# EAGLE schematic Placa_processamento (EAGLE 9.6.2)
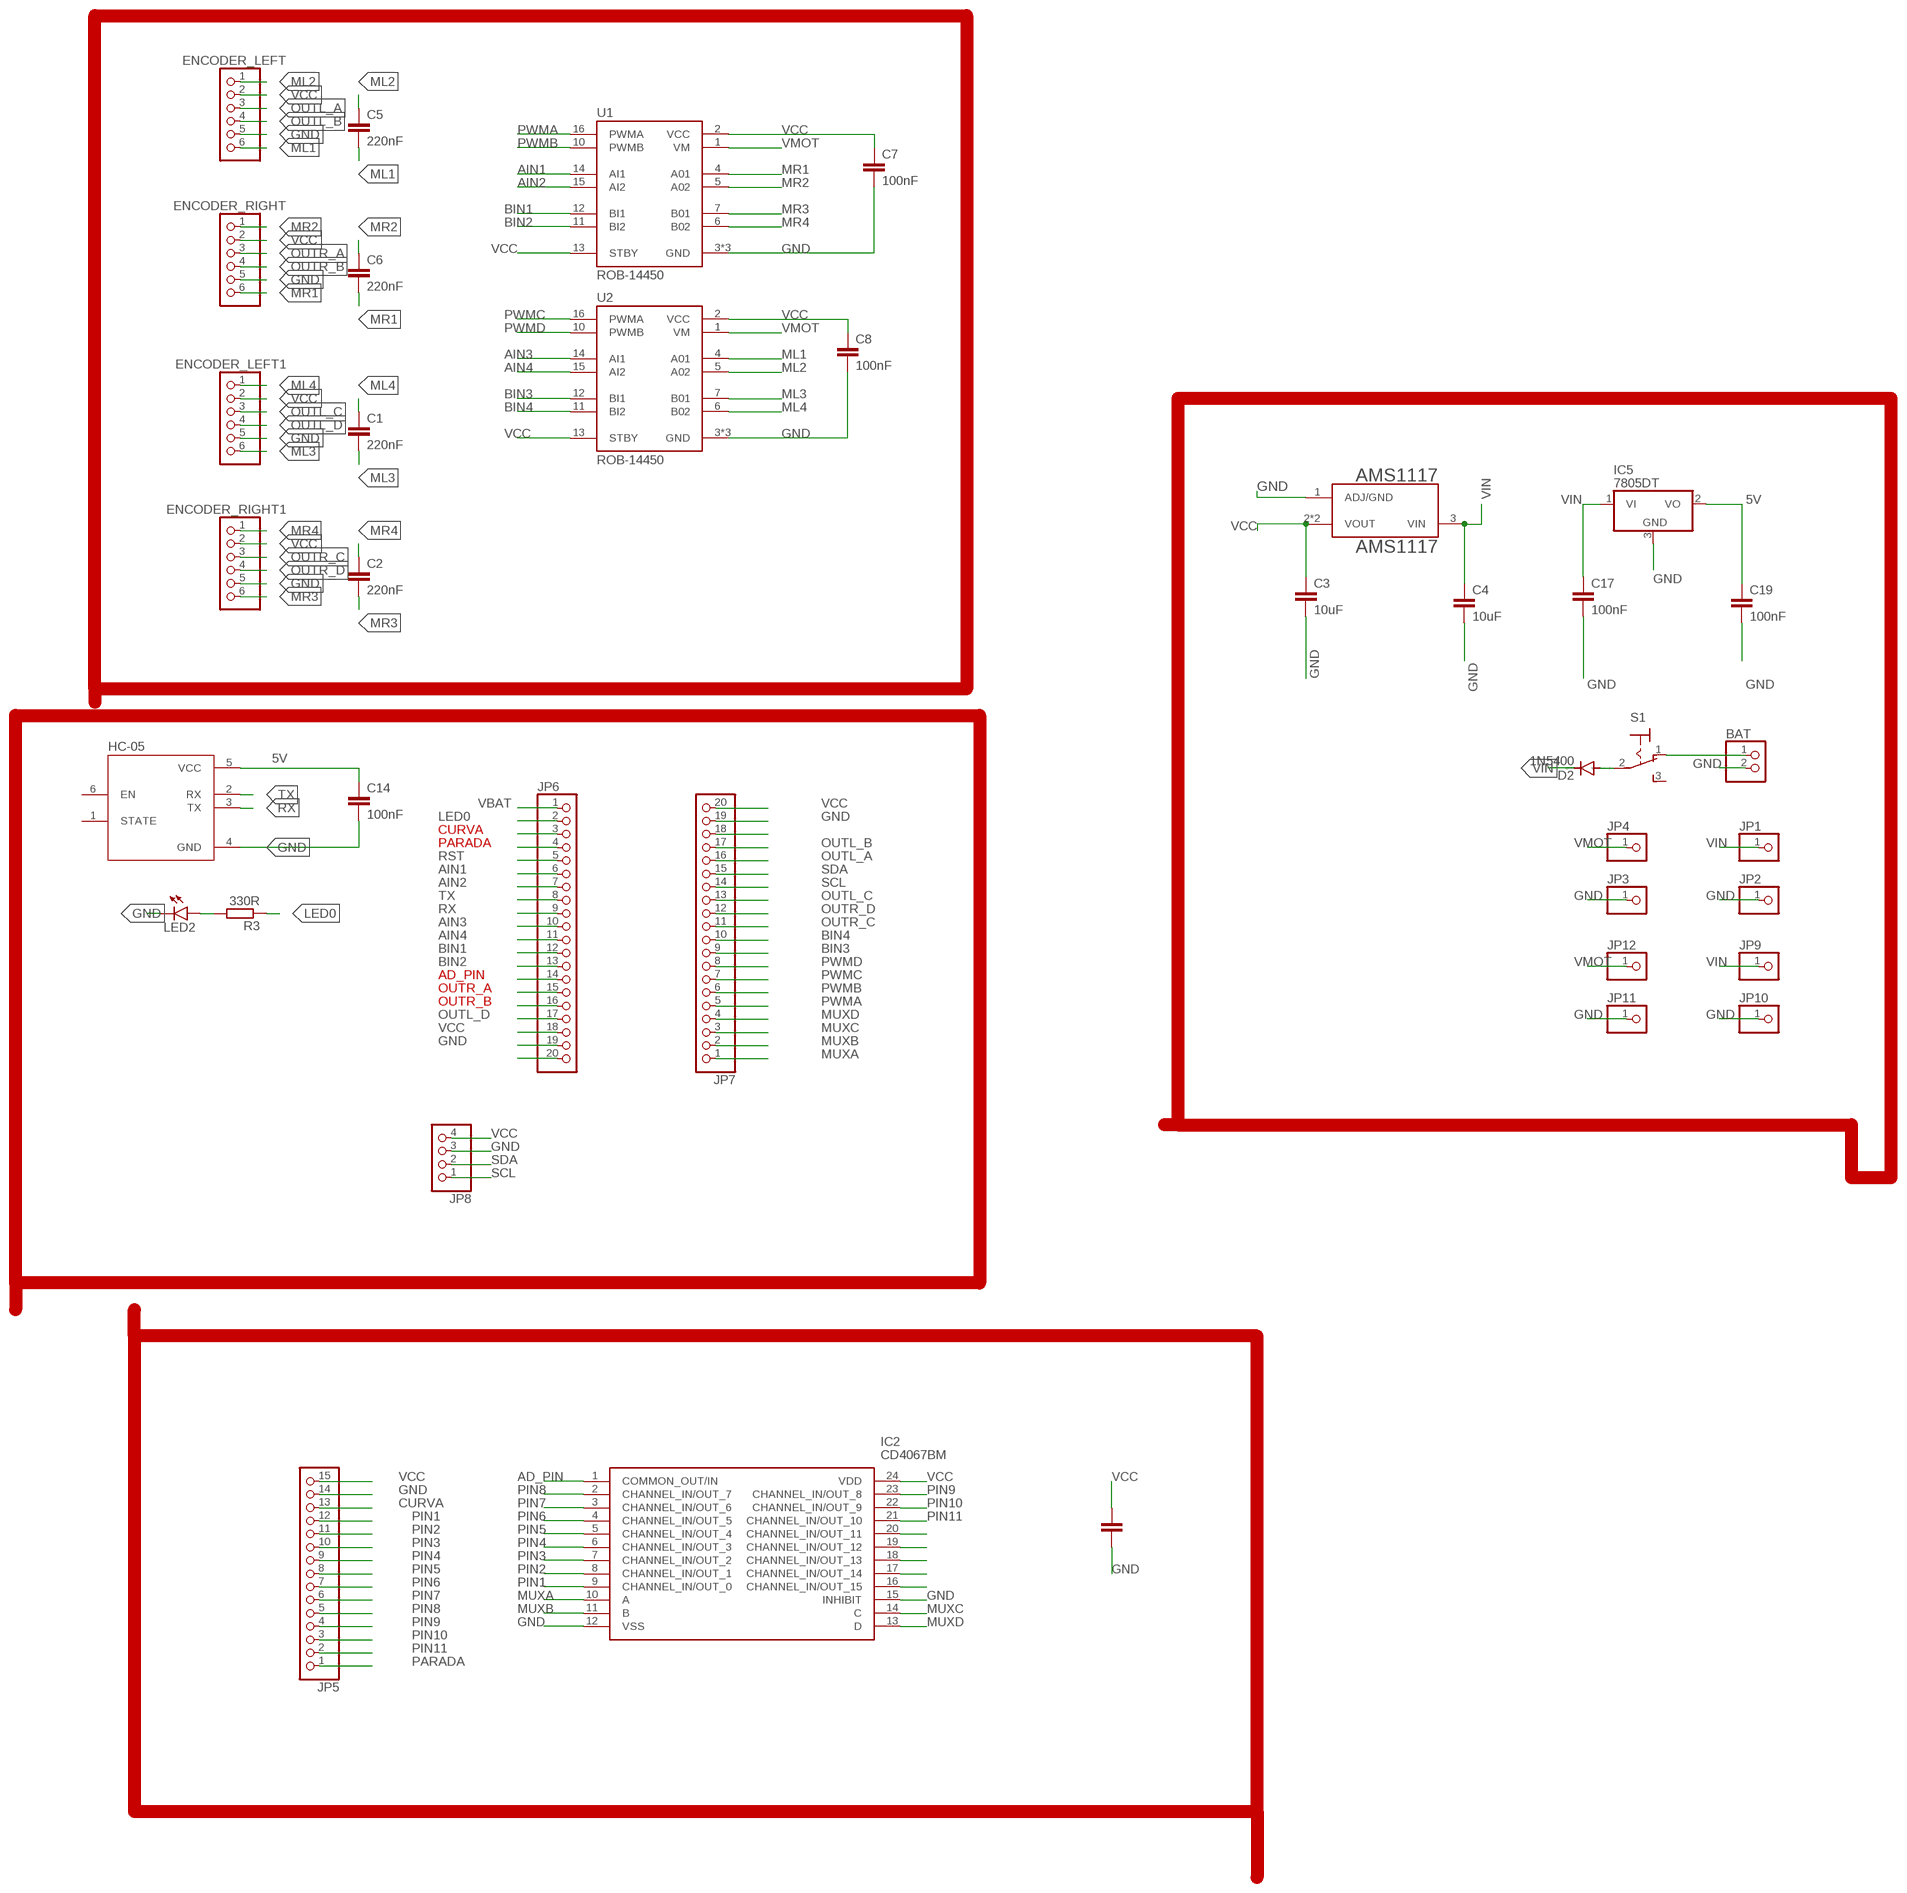
[diagram p0: schematic, sheet 1]

## Parts
AMS1117  AMS1117  [SOT229P700X180-4N]
BAT  PINHD-1X2  [1X02]
C1  220nF  C-EUC0805  [C0805]
C2  220nF  C-EUC0805  [C0805]
C3  10uF  C-EUC0805  [C0805]
C4  10uF  C-EUC0805  [C0805]
C5  220nF  C-EUC0805  [C0805]
C6  220nF  C-EUC0805  [C0805]
C7  100nF  C-EUC0805  [C0805]
C8  100nF  C-EUC0805  [C0805]
C10  100nF  C-EUC0805  [C0805]
C14  100nF  C-EUC0805  [C0805]
C17  100nF  C-EUC0805  [C0805]
C19  100nF  C-EUC0805  [C0805]
D2  1N5400  [DO201-15]
ENCODER_LEFT  PINHD-1X6  [1X06]
ENCODER_LEFT1  PINHD-1X6  [1X06]
ENCODER_RIGHT  PINHD-1X6  [1X06]
ENCODER_RIGHT1  PINHD-1X6  [1X06]
HC-05  ZC142200  [MODULE_ZC142200]
IC2  CD4067BM  [SOIC127P1030X265-24N]
IC5  7805DT  [TO252]
JP1  PINHD-1X1  [1X01]
JP2  PINHD-1X1  [1X01]
JP3  PINHD-1X1  [1X01]
JP4  PINHD-1X1  [1X01]
JP5  PINHD-1X15  [1X15]
JP6  PINHD-1X20  [1X20]
JP7  PINHD-1X20  [1X20]
JP8  PINHD-1X4  [1X04]
JP9  PINHD-1X1  [1X01]
JP10  PINHD-1X1  [1X01]
JP11  PINHD-1X1  [1X01]
JP12  PINHD-1X1  [1X01]
LED2  LEDCHIPLED_0805  [CHIPLED_0805]
R3  330R  R-EU_R0805  [R0805]
S1  320-916  [320-916]
U1  ROB-14450  [MODULE_ROB-14450]
U2  ROB-14450  [MODULE_ROB-14450]

## Nets
5V: C14.1 C19.1 HC-05.5(VCC) IC5.2(VO)
AD_PIN: IC2.1(COMMON_OUT/IN) JP6.14
AIN1: JP6.6 U1.14(AI1)
AIN2: JP6.7 U1.15(AI2)
AIN3: JP6.10 U2.14(AI1)
AIN4: JP6.11 U2.15(AI2)
BIN1: JP6.12 U1.12(BI1)
BIN2: JP6.13 U1.11(BI2)
BIN3: JP7.9 U2.12(BI1)
BIN4: JP7.10 U2.11(BI2)
CURVA: JP5.13 JP6.3
GND: AMS1117.1(ADJ/GND) BAT.2 C3.2 C4.2 C7.2 C8.2 C10.2 C14.2 C17.2 C19.2 ENCODER_LEFT1.5 ENCODER_LEFT.5 ENCODER_RIGHT1.5 ENCODER_RIGHT.5 HC-05.4(GND) IC2.12(VSS) IC2.15(INHIBIT) IC5.3(GND) JP2.1 JP3.1 JP5.14 JP6.19 JP7.19 JP8.3 JP10.1 JP11.1 LED2.C U1.3(GND) U1.8(GND) U1.9(GND) U2.3(GND) U2.8(GND) U2.9(GND)
LED0: JP6.2 R3.1
ML1: C5.2 ENCODER_LEFT.6 U2.4(A01)
ML2: C5.1 ENCODER_LEFT.1 U2.5(A02)
ML3: C1.2 ENCODER_LEFT1.6 U2.7(B01)
ML4: C1.1 ENCODER_LEFT1.1 U2.6(B02)
MR1: C6.2 ENCODER_RIGHT.6 U1.4(A01)
MR2: C6.1 ENCODER_RIGHT.1 U1.5(A02)
MR3: C2.2 ENCODER_RIGHT1.6 U1.7(B01)
MR4: C2.1 ENCODER_RIGHT1.1 U1.6(B02)
MUXA: IC2.10(A) JP7.1
MUXB: IC2.11(B) JP7.2
MUXC: IC2.14(C) JP7.3
MUXD: IC2.13(D) JP7.4
N$2: D2.A S1.2(P)
N$3: BAT.1 S1.1(O)
N$4: LED2.A R3.2
N$19: IC2.16(CHANNEL_IN/OUT_15)
N$20: IC2.17(CHANNEL_IN/OUT_14)
N$21: IC2.18(CHANNEL_IN/OUT_13)
N$22: IC2.19(CHANNEL_IN/OUT_12)
N$38: JP6.20
NET: JP7.18
NET$7: IC2.20(CHANNEL_IN/OUT_11)
OUTL_A: ENCODER_LEFT.3 JP7.16
OUTL_B: ENCODER_LEFT.4 JP7.17
OUTL_C: ENCODER_LEFT1.3 JP7.13
OUTL_D: ENCODER_LEFT1.4 JP6.17
OUTR_A: ENCODER_RIGHT.3 JP6.15
OUTR_B: ENCODER_RIGHT.4 JP6.16
OUTR_C: ENCODER_RIGHT1.3 JP7.11
OUTR_D: ENCODER_RIGHT1.4 JP7.12
PARADA: JP5.1 JP6.4
PIN1: IC2.9(CHANNEL_IN/OUT_0) JP5.12
PIN2: IC2.8(CHANNEL_IN/OUT_1) JP5.11
PIN3: IC2.7(CHANNEL_IN/OUT_2) JP5.10
PIN4: IC2.6(CHANNEL_IN/OUT_3) JP5.9
PIN5: IC2.5(CHANNEL_IN/OUT_4) JP5.8
PIN6: IC2.4(CHANNEL_IN/OUT_5) JP5.7
PIN7: IC2.3(CHANNEL_IN/OUT_6) JP5.6
PIN8: IC2.2(CHANNEL_IN/OUT_7) JP5.5
PIN9: IC2.23(CHANNEL_IN/OUT_8) JP5.4
PIN10: IC2.22(CHANNEL_IN/OUT_9) JP5.3
PIN11: IC2.21(CHANNEL_IN/OUT_10) JP5.2
PWMA: JP7.5 U1.16(PWMA)
PWMB: JP7.6 U1.10(PWMB)
PWMC: JP7.7 U2.16(PWMA)
PWMD: JP7.8 U2.10(PWMB)
RST: JP6.5
RX: HC-05.3(TX) JP6.9
SCL: JP7.14 JP8.1
SDA: JP7.15 JP8.2
TX: HC-05.2(RX) JP6.8
VBAT: JP6.1
VCC: AMS1117.2(VOUT) AMS1117.4(VOUT) C3.1 C7.1 C8.1 C10.1 ENCODER_LEFT1.2 ENCODER_LEFT.2 ENCODER_RIGHT1.2 ENCODER_RIGHT.2 IC2.24(VDD) JP5.15 JP6.18 JP7.20 JP8.4 U1.2(VCC) U1.13(STBY) U2.2(VCC) U2.13(STBY)
VIN: AMS1117.3(VIN) C4.1 C17.1 D2.C IC5.1(VI) JP1.1 JP9.1
VMOT: JP4.1 JP12.1 U1.1(VM) U2.1(VM)
Unconnected: HC-05.1(STATE) HC-05.6(EN) S1.3(S)

## Library data of the parts
AMS1117 = AMS1117_REGULADOR:AMS1117: Sot223/Pkg 1-Amp 5-Volt Low Drop Out Voltage Regulatator Check prices <https://pricing.snapeda.com/parts/AMS1117/Advanced%20Monolithic%20Systems/view-part?ref=eda>; AVAILABILITY: In Stock; DESCRIPTION: 1A LOW DROPOUT VOLTAGE REGULATOR SOT-223; MF: Advanced Monolithic Systems; MP: AMS1117; PACKAGE: SOT-223 Seeed Technology; PRICE: None
BAT = pinhead:PINHD-1X2: PIN HEADER
C1-C8 C10 C14 C17 C19 = rcl:C-EU: CAPACITOR, European symbol; SPICEPREFIX: C
D2 = diode:1N5400: DIODE standard rectifier, 3 A, 50 V (Motorola)
ENCODER_LEFT ENCODER_LEFT1 ENCODER_RIGHT ENCODER_RIGHT1 = pinhead:PINHD-1X6: PIN HEADER
HC-05 = HC-05:ZC142200: 1pc HC-05 6 Pin Wireless Bluetooth RF Transceiver Module Serial For Arduino Check prices <https://pricing.snapeda.com/parts/ZC142200/YKS/view-part?ref=eda>; AVAILABILITY: Not in stock; DESCRIPTION: 1pc HC-05 6 Pin Wireless Bluetooth RF Transceiver Module Serial For Arduino; MF: YKS; MP: ZC142200; PACKAGE: None; PRICE: None
IC2 = CD4067BM:CD4067BM: Analog Multiplexer/Demultiplexer SOIC24 Texas Instruments CD4067BM, Multiplexer/Demultiplexer Single 16:1, 3 18 V, 24-Pin SOIC Source: Datasheet <http://www.ti.com/lit/ds/symlink/cd4067b.pdf>; ARROW_PART_NUMBER: CD4067BM; ARROW_PRICE-STOCK: https://www.arrow.com/en/products/cd4067bm/texas-instruments; DESCRIPTION: Analog Multiplexer/Demultiplexer SOIC24 Texas Instruments CD4067BM, Multiplexer/Demultiplexer Single 16:1, 3 18 V, 24-Pin SOIC; HEIGHT: 2.65mm; MANUFACTURER_NAME: Texas Instruments; MANUFACTURER_PART_NUMBER: CD4067BM; MOUSER_PART_NUMBER: 595-CD4067BM; MOUSER_PRICE-STOCK: https://www.mouser.co.uk/ProductDetail/Texas-Instruments/CD4067BM?qs=LSR%252BNeaw%2FwBojsvkXxI5Ew%3D%3D
IC5 = linear:78*: Positive VOLTAGE REGULATOR Source: http://cache.national.com/ds/LM/LM78L05.pdf http://www.fairchildsemi.com/ds/LM/LM7805.pdf
JP1-JP4 JP9-JP12 = pinhead:PINHD-1X1: PIN HEADER
JP5 = pinhead:PINHD-1X15: PIN HEADER
JP6 JP7 = pinhead:PINHD-1X20: PIN HEADER
JP8 = pinhead:PINHD-1X4: PIN HEADER
LED2 = led:LED: LED OSRAM: - CHIPLED LG R971, LG N971, LY N971, LG Q971, LY Q971, LO R971, LY R971 LH N974, LH R974 LS Q976, LO Q976, LY Q976 LO Q996 - Hyper CHIPLED LW Q18S LB Q993, LB Q99A, LB R99A - SideLED LS A670, LO A670, LY A670, LG A670, LP A670 LB A673, LV A673, LT A673, LW A673 LH A674 LY A675 LS A676, LA A676, LO A676, LY A676, LW A676 LS A679, LY A679, LG A679 - Hyper Micro SIDELED® LS Y876, LA Y876, LO Y876, LY Y876 LT Y87S - SmartLED LW L88C, LW L88S LB L89C, LB L89S, LG L890 LS L89K, LO L89K, LY L89K LS L896, LA L896, LO L896, LY L896 - TOPLED LS T670, LO T670, LY T670, LG T670, LP T670 LSG T670, LSP T670, LSY T670, LOP T670, LYG T670 LG T671, LOG T671, LSG T671 LB T673, LV T673, LT T673, LW T673 LH T674 LS T676, LA T676, LO T676, LY T676, LB T676, LH T676, LSB T676, LW T676 LB T67C, LV T67C, LT T67C, LS T67K, LO T67K, LY T67K, LW E67C LS E67B, LA E67B, LO E67B, LY E67B, LB E67C, LV E67C, LT E67C LW T67C LS T679, LY T679, LG T679 LS T770, LO T770, LY T770, LG T770, LP T770 LB T773, LV T773, LT T773, LW T773 LH T774 LS E675, LA E675, LY E675, LS T675 LS T776, LA T776, LO T776, LY T776, LB T776 LHGB T686 LT T68C, LB T68C - Hyper Mini TOPLED® LB M676 - Mini TOPLED Santana® LG M470 LS M47K, LO M47K, LY M47K Source: http://www.osram.convergy.de LUXEON: - LUMILED® LXK2-PW12-R00, LXK2-PW12-S00, LXK2-PW14-U00, LXK2-PW14-V00 LXK2-PM12-R00, LXK2-PM12-S00, LXK2-PM14-U00 LXK2-PE12-Q00, LXK2-PE12-R00, LXK2-PE12-S00, LXK2-PE14-T00, LXK2-PE14-U00 LXK2-PB12-K00, LXK2-PB12-L00, LXK2-PB12-M00, LXK2-PB14-N00, LXK2-PB14-P00, LXK2-PB14-Q00 LXK2-PR12-L00, LXK2-PR12-M00, LXK2-PR14-Q00, LXK2-PR14-R00 LXK2-PD12-Q00, LXK2-PD12-R00, LXK2-PD12-S00 LXK2-PH12-R00, LXK2-PH12-S00 LXK2-PL12-P00, LXK2-PL12-Q00, LXK2-PL12-R00 Source: www.luxeon.com KINGBRIGHT: KA-3528ASYC Source: www.kingbright.com
R3 = rcl:R-EU_: RESISTOR, European symbol; SPICEPREFIX: R
S1 = switch:320-916: TOGGLE SWITCH distributor RS Components
U1 U2 = ROB-14450:ROB-14450: TB6612FNG Motor Controller/Driver Power Management Evaluation Board Check availability <https://pricing.snapeda.com/parts/ROB-14450/SparkFun%20Electronics/view-part?ref=eda>; AVAILABILITY: In Stock; DESCRIPTION: TB6612FNG Motor Controller/Driver Power Management Evaluation Board; MF: SparkFun Electronics; MP: ROB-14450; PACKAGE: None; PRICE: None; PURCHASE-URL: https://pricing.snapeda.com/search/part/ROB-14450/?ref=eda